# Altium schematic sheet Overview.SchDoc
size 297 x 209 mm; SheetNumber: 1; SheetTotal: 6
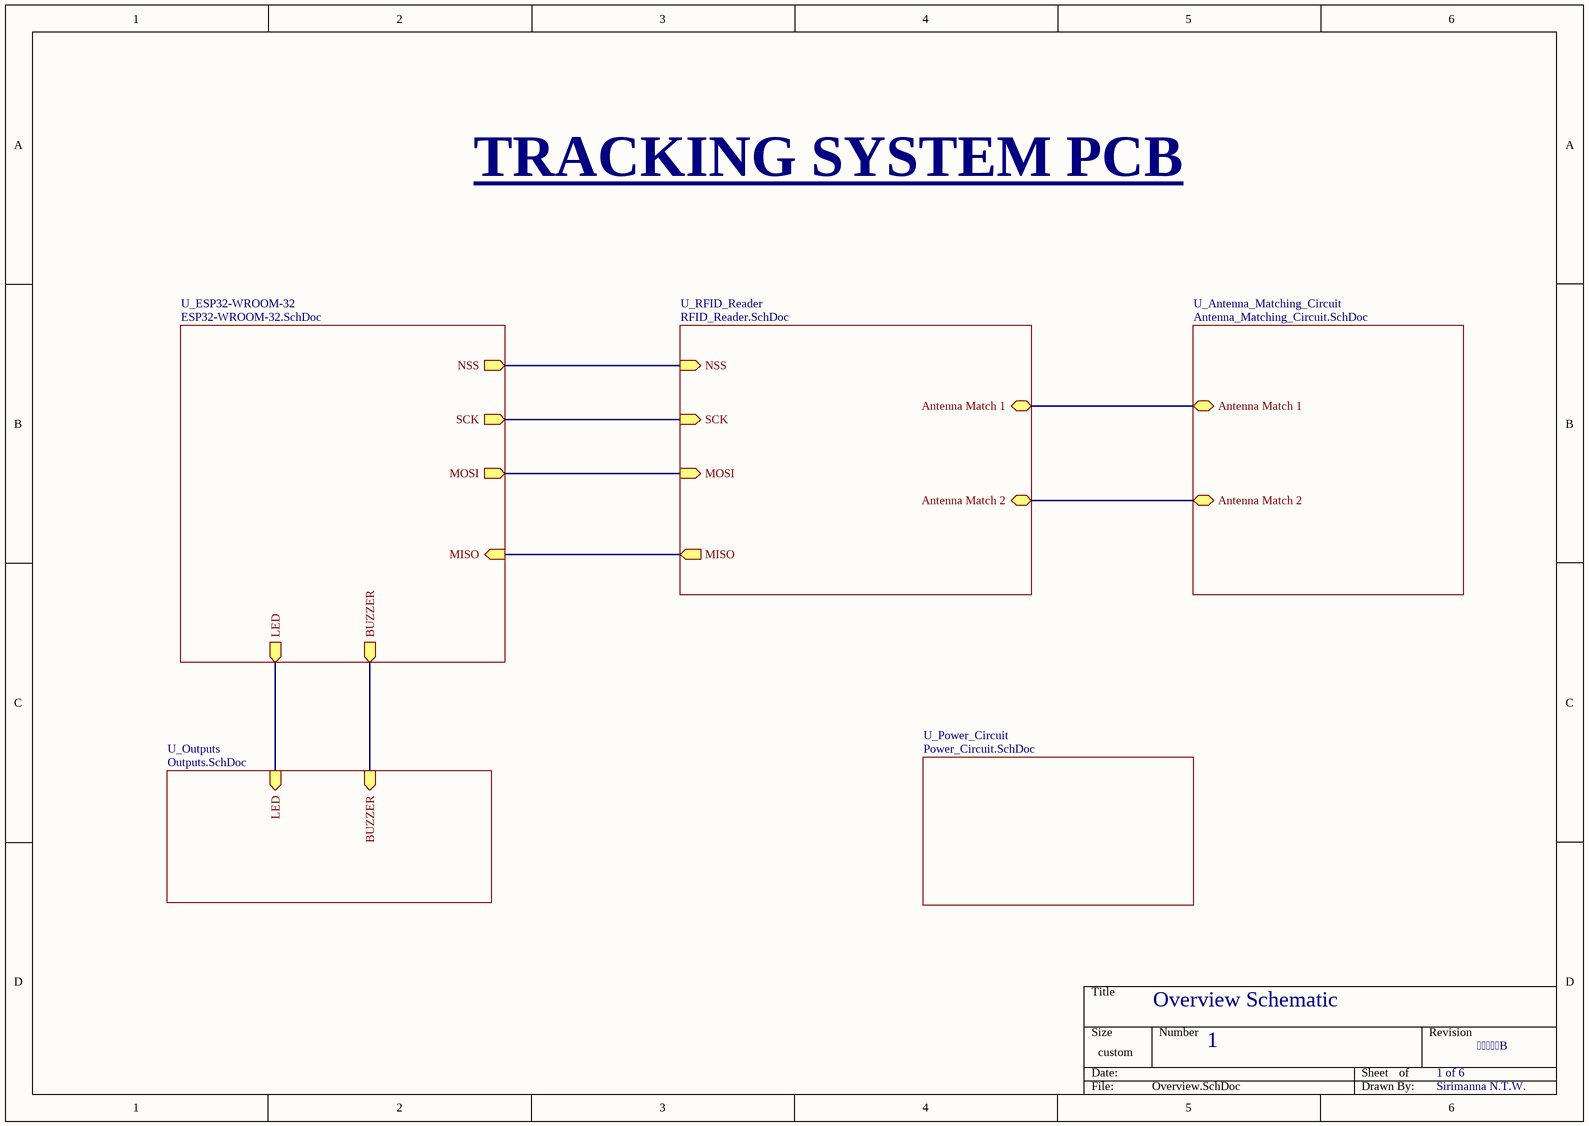
[diagram p0: Overview.SchDoc]

## Sub-sheets
U_Antenna_Matching_Circuit = Antenna_Matching_Circuit.SchDoc: Antenna Match 1 (bidir), Antenna Match 2 (bidir)
U_ESP32-WROOM-32 = ESP32-WROOM-32.SchDoc: SCK (out), MISO (in), MOSI (out), NSS (out), BUZZER (out), LED (out)
U_Outputs = Outputs.SchDoc: BUZZER (in), LED (in)
U_Power_Circuit = Power_Circuit.SchDoc: no entries
U_RFID_Reader = RFID_Reader.SchDoc: Antenna Match 1 (bidir), Antenna Match 2 (bidir), NSS (in), SCK (in), MOSI (in), MISO (out)

## Nets
(unnamed): sheet U_ESP32-WROOM-32/SCK, sheet U_RFID_Reader/SCK
(unnamed): sheet U_ESP32-WROOM-32/MISO, sheet U_RFID_Reader/MISO
(unnamed): sheet U_ESP32-WROOM-32/MOSI, sheet U_RFID_Reader/MOSI
(unnamed): sheet U_ESP32-WROOM-32/NSS, sheet U_RFID_Reader/NSS
(unnamed): sheet U_ESP32-WROOM-32/BUZZER, sheet U_Outputs/BUZZER
(unnamed): sheet U_ESP32-WROOM-32/LED, sheet U_Outputs/LED
(unnamed): sheet U_RFID_Reader/Antenna Match 1, sheet U_Antenna_Matching_Circuit/Antenna Match 1
(unnamed): sheet U_RFID_Reader/Antenna Match 2, sheet U_Antenna_Matching_Circuit/Antenna Match 2

## Notes on the sheet
- TRACKING SYSTEM PCB
- Overview Schematic
- 1
- 1 of 6
- B
- Sirimanna N.T.W.